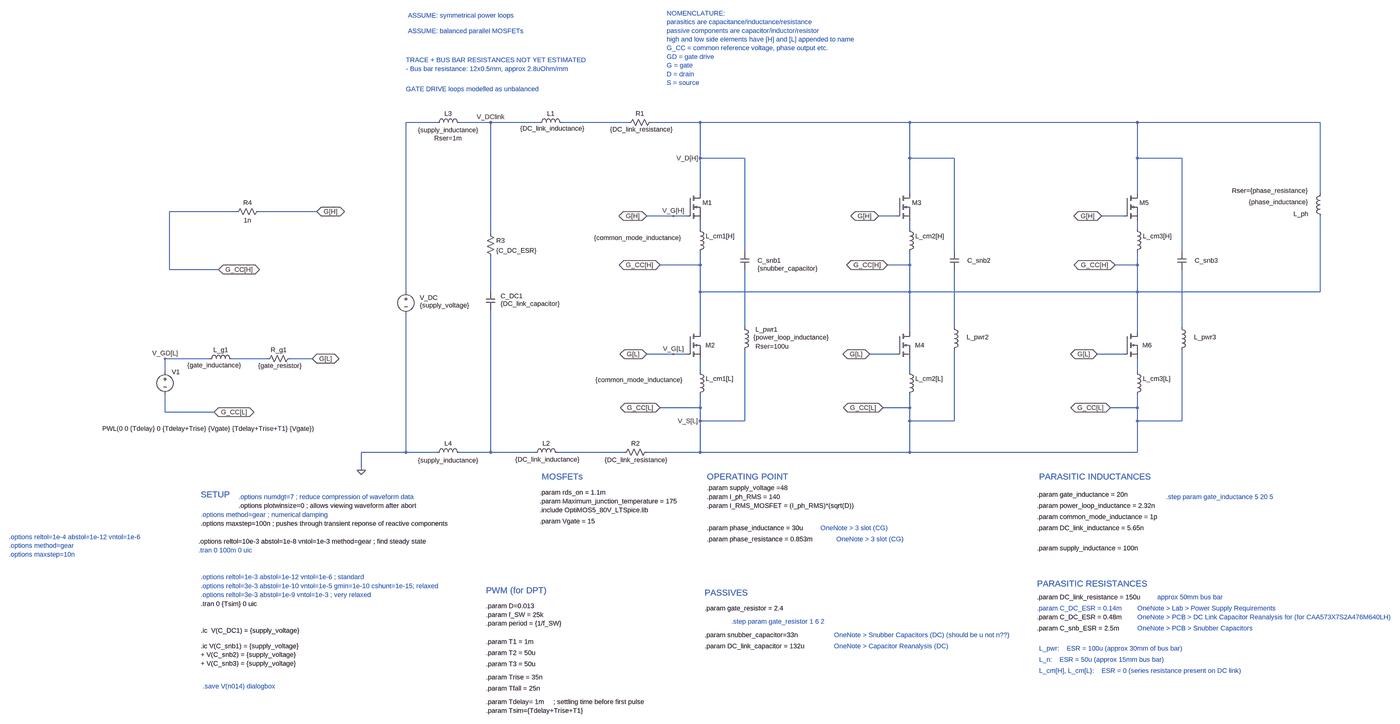
[diagram p0: schematic InverterBalancedDPT_debug.asc, whole sheet]
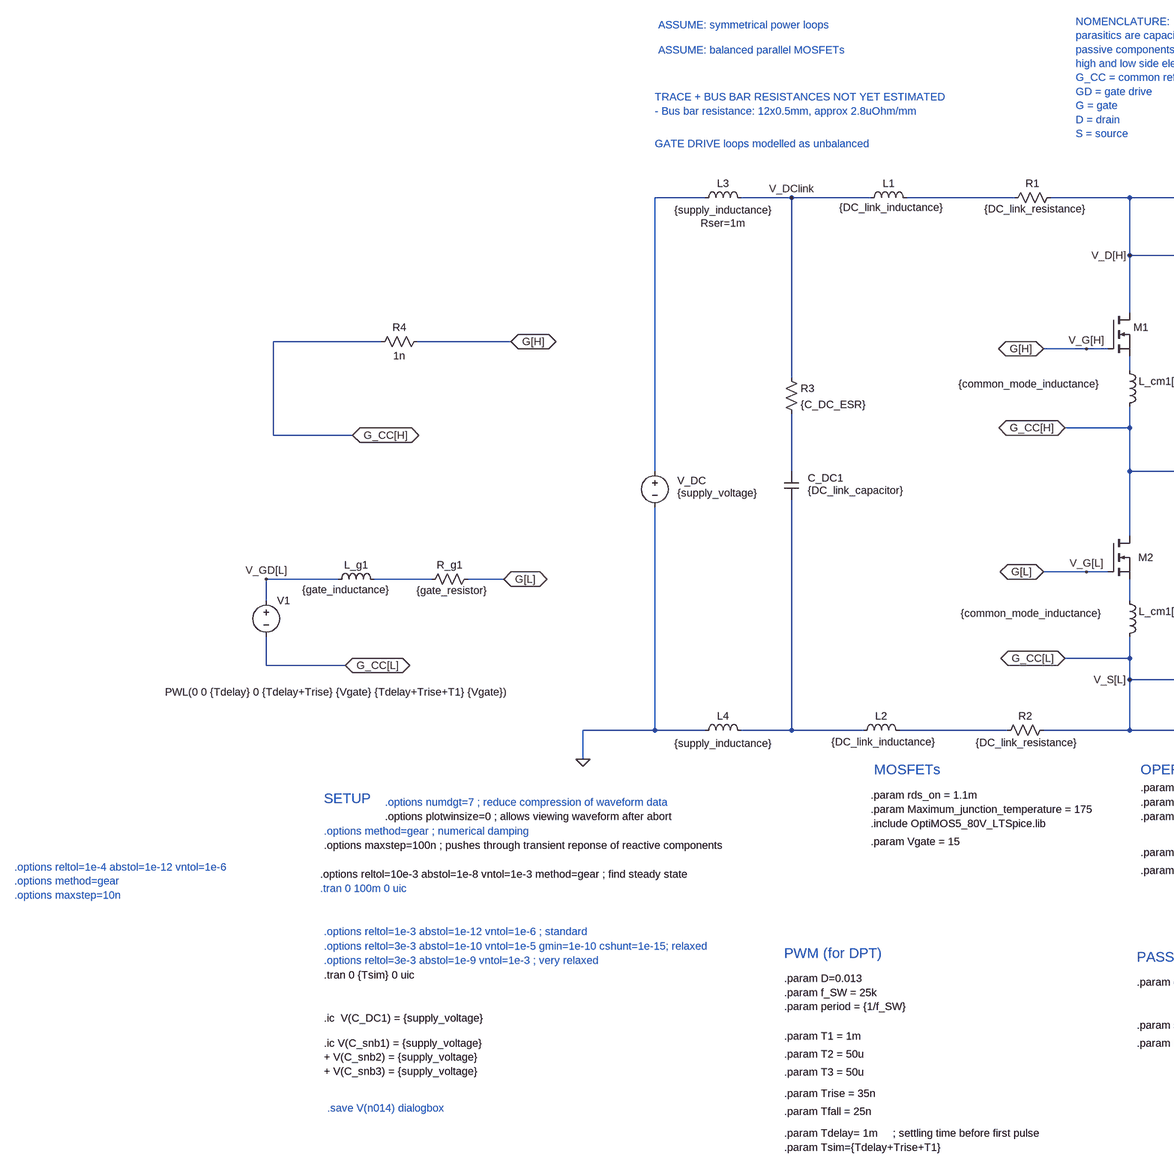
[diagram p1: schematic InverterBalancedDPT_debug.asc, part, row 1 of 1, column 1 of 2]
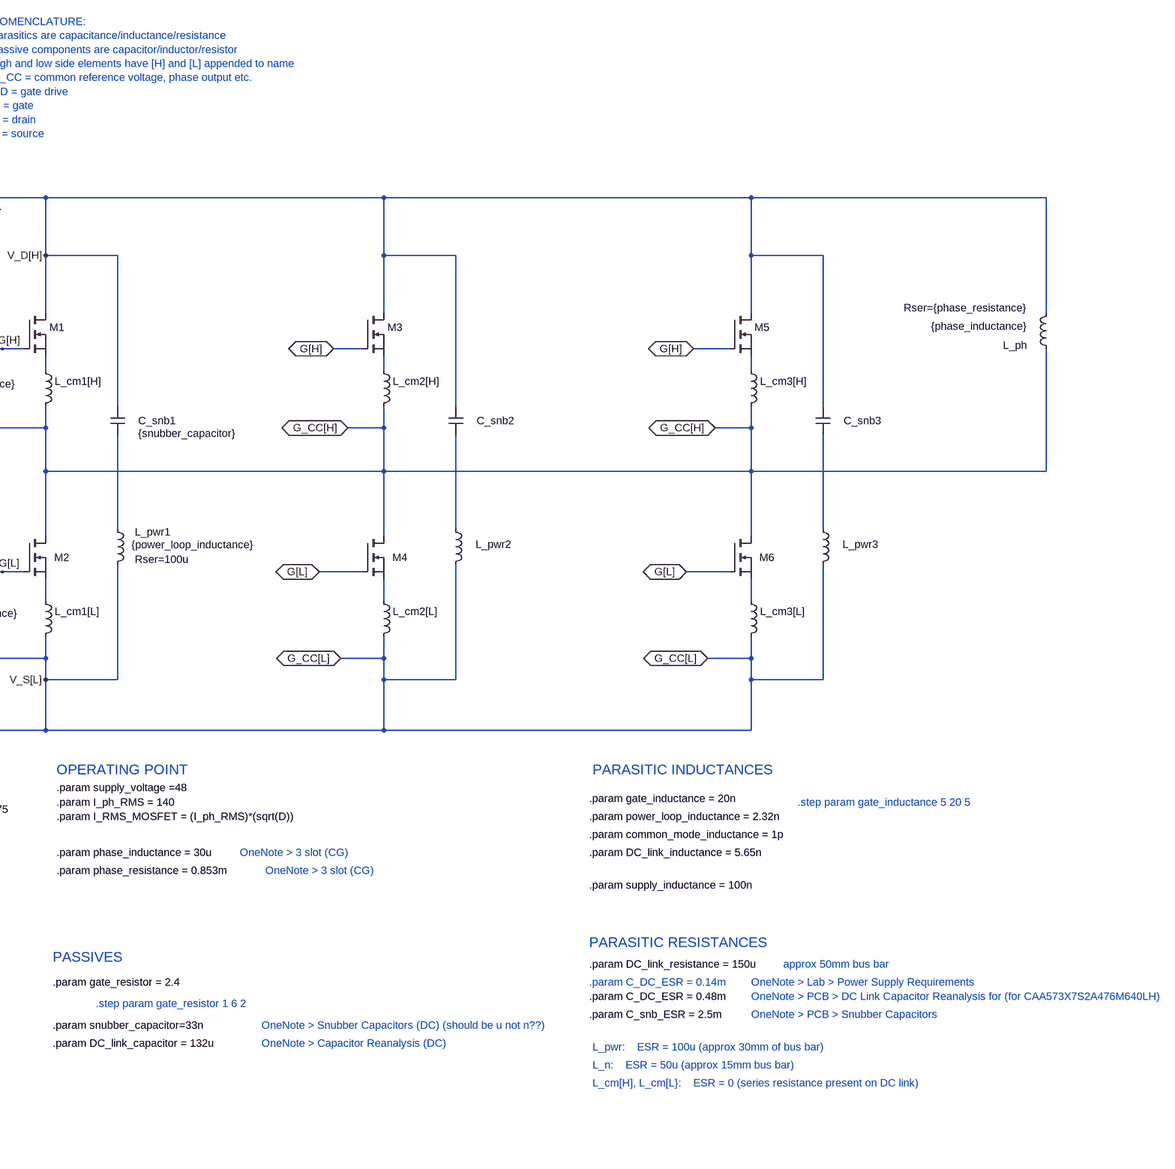
[diagram p2: schematic InverterBalancedDPT_debug.asc, part, row 1 of 1, column 2 of 2]
InverterBalancedDPT_debug.asc, the LTspice schematic file:
Version 4.1
SHEET 1 7948 3392
WIRE 1136 -928 1024 -928
WIRE 1328 -928 1216 -928
WIRE 1504 -928 1328 -928
WIRE 1824 -928 1584 -928
WIRE 2080 -928 1904 -928
WIRE 2832 -928 2080 -928
WIRE 3648 -928 2832 -928
WIRE 4304 -928 3648 -928
WIRE 2080 -800 2080 -928
WIRE 2240 -800 2080 -800
WIRE 2832 -800 2832 -928
WIRE 2992 -800 2832 -800
WIRE 3648 -800 3648 -928
WIRE 3808 -800 3648 -800
WIRE 2080 -672 2080 -800
WIRE 2832 -672 2832 -800
WIRE 3648 -672 3648 -800
WIRE 4304 -672 4304 -928
WIRE 416 -608 176 -608
WIRE 704 -608 496 -608
WIRE 1984 -592 1888 -592
WIRE 2032 -592 1984 -592
WIRE 2080 -592 2080 -608
WIRE 2784 -592 2720 -592
WIRE 2832 -592 2832 -608
WIRE 3600 -592 3520 -592
WIRE 3648 -592 3648 -608
WIRE 2080 -544 2080 -576
WIRE 2832 -544 2832 -576
WIRE 3648 -544 3648 -576
WIRE 1328 -528 1328 -928
WIRE 2240 -464 2240 -800
WIRE 2992 -464 2992 -800
WIRE 3808 -464 3808 -800
WIRE 2080 -416 2080 -464
WIRE 2080 -416 1936 -416
WIRE 2832 -416 2832 -464
WIRE 2832 -416 2752 -416
WIRE 3648 -416 3648 -464
WIRE 3648 -416 3568 -416
WIRE 176 -400 176 -608
WIRE 352 -400 176 -400
WIRE 1024 -320 1024 -928
WIRE 1328 -320 1328 -448
WIRE 2080 -320 2080 -416
WIRE 2832 -320 2832 -416
WIRE 2832 -320 2080 -320
WIRE 3648 -320 3648 -416
WIRE 3648 -320 2832 -320
WIRE 4304 -320 4304 -592
WIRE 4304 -320 3648 -320
WIRE 2240 -192 2240 -400
WIRE 2992 -192 2992 -400
WIRE 3808 -192 3808 -400
WIRE 2080 -176 2080 -320
WIRE 2832 -176 2832 -320
WIRE 3648 -176 3648 -320
WIRE 1984 -96 1888 -96
WIRE 2032 -96 1984 -96
WIRE 2784 -96 2688 -96
WIRE 3600 -96 3504 -96
WIRE 320 -80 160 -80
WIRE 528 -80 400 -80
WIRE 688 -80 608 -80
WIRE 160 -32 160 -80
WIRE 2080 -32 2080 -80
WIRE 2832 -32 2832 -80
WIRE 3648 -32 3648 -80
WIRE 2080 96 2080 48
WIRE 2080 96 1936 96
WIRE 2832 96 2832 48
WIRE 2832 96 2736 96
WIRE 3648 96 3648 48
WIRE 3648 96 3552 96
WIRE 160 112 160 48
WIRE 336 112 160 112
WIRE 2080 144 2080 96
WIRE 2240 144 2240 -112
WIRE 2240 144 2080 144
WIRE 2832 144 2832 96
WIRE 2992 144 2992 -112
WIRE 2992 144 2832 144
WIRE 3648 144 3648 96
WIRE 3808 144 3808 -112
WIRE 3808 144 3648 144
WIRE 1024 256 1024 -240
WIRE 1024 256 864 256
WIRE 1136 256 1024 256
WIRE 1328 256 1328 -256
WIRE 1328 256 1216 256
WIRE 1488 256 1328 256
WIRE 1808 256 1568 256
WIRE 2080 256 2080 144
WIRE 2080 256 1888 256
WIRE 2832 256 2832 144
WIRE 2832 256 2080 256
WIRE 3648 256 3648 144
WIRE 3648 256 2832 256
WIRE 864 320 864 256
FLAG 704 -608 G[H]
IOPIN 704 -608 BiDir
FLAG 688 -80 G[L]
IOPIN 688 -80 BiDir
FLAG 1888 -592 G[H]
IOPIN 1888 -592 BiDir
FLAG 1888 -96 G[L]
IOPIN 1888 -96 BiDir
FLAG 864 320 0
FLAG 1936 -416 G_CC[H]
IOPIN 1936 -416 BiDir
FLAG 352 -400 G_CC[H]
IOPIN 352 -400 BiDir
FLAG 1984 -592 V_G[H]
FLAG 1984 -96 V_G[L]
FLAG 2080 -800 V_D[H]
FLAG 2080 144 V_S[L]
FLAG 160 -80 V_GD[L]
FLAG 1328 -928 V_DClink
FLAG 2720 -592 G[H]
IOPIN 2720 -592 BiDir
FLAG 1936 96 G_CC[L]
IOPIN 1936 96 BiDir
FLAG 336 112 G_CC[L]
IOPIN 336 112 BiDir
FLAG 2688 -96 G[L]
IOPIN 2688 -96 BiDir
FLAG 3504 -96 G[L]
IOPIN 3504 -96 BiDir
FLAG 3520 -592 G[H]
IOPIN 3520 -592 BiDir
FLAG 2752 -416 G_CC[H]
IOPIN 2752 -416 BiDir
FLAG 3568 -416 G_CC[H]
IOPIN 3568 -416 BiDir
FLAG 2736 96 G_CC[L]
IOPIN 2736 96 BiDir
FLAG 3552 96 G_CC[L]
IOPIN 3552 96 BiDir
SYMBOL voltage 1024 -336 R0
WINDOW 3 50 65 Left 2
WINDOW 0 50 37 Left 2
WINDOW 123 0 0 Left 0
SYMATTR Value {supply_voltage}
SYMATTR InstName V_DC
SYMATTR SpiceLine Rser=0
SYMBOL cap 1312 -320 R0
WINDOW 0 52 15 Left 2
WINDOW 3 52 43 Left 2
SYMATTR InstName C_DC1
SYMATTR Value {DC_link_capacitor}
SYMATTR SpiceLine Rser=0
SYMBOL cap 2224 -464 R0
WINDOW 0 62 32 Left 2
WINDOW 3 62 60 Left 2
SYMATTR InstName C_snb1
SYMATTR Value {snubber_capacitor}
SYMATTR SpiceLine Rser=0
SYMBOL ind 4320 -576 R180
WINDOW 0 58 24 Left 2
WINDOW 3 59 66 Left 2
WINDOW 39 61 107 Left 2
SYMATTR InstName L_ph
SYMATTR Value {phase_inductance}
SYMATTR SpiceLine Rser={phase_resistance}
SYMBOL nmos 2032 -672 R0
WINDOW 3 56 72 Invisible 2
SYMATTR Value IPTG011N08NM5_L0
SYMATTR InstName M1
SYMATTR Prefix X
SYMBOL nmos 2032 -176 R0
WINDOW 0 67 48 Left 2
WINDOW 3 56 72 Invisible 2
SYMATTR InstName M2
SYMATTR Value IPTG011N08NM5_L0
SYMATTR Prefix X
SYMBOL ind 2064 -560 R0
WINDOW 3 -365 46 Left 2
SYMATTR Value {common_mode_inductance}
SYMATTR InstName L_cm1[H]
SYMATTR SpiceLine Rser=0
SYMBOL ind 2064 -48 R0
WINDOW 3 -360 44 Left 2
SYMATTR Value {common_mode_inductance}
SYMATTR InstName L_cm1[L]
SYMATTR SpiceLine Rser=0
SYMBOL ind 2224 -208 R0
WINDOW 0 54 23 Left 2
WINDOW 3 47 52 Left 2
WINDOW 39 54 84 Left 2
SYMATTR InstName L_pwr1
SYMATTR Value {power_loop_inductance}
SYMATTR SpiceLine Rser=100u
SYMBOL cap 2976 -464 R0
WINDOW 0 62 32 Left 2
WINDOW 3 24 56 Invisible 2
SYMATTR InstName C_snb2
SYMATTR Value {snubber_capacitor}
SYMBOL nmos 2784 -672 R0
WINDOW 3 56 72 Invisible 2
SYMATTR Value IPTG011N08NM5_L0
SYMATTR InstName M3
SYMATTR Prefix X
SYMBOL nmos 2784 -176 R0
WINDOW 0 67 48 Left 2
WINDOW 3 56 72 Invisible 2
SYMATTR InstName M4
SYMATTR Value IPTG011N08NM5_L0
SYMATTR Prefix X
SYMBOL ind 2816 -560 R0
WINDOW 3 36 80 Invisible 2
SYMATTR Value {common_mode_inductance}
SYMATTR InstName L_cm2[H]
SYMATTR SpiceLine Rser=0
SYMBOL ind 2816 -48 R0
WINDOW 3 36 80 Invisible 2
SYMATTR Value {common_mode_inductance}
SYMATTR InstName L_cm2[L]
SYMATTR SpiceLine Rser=0
SYMBOL ind 2976 -208 R0
WINDOW 0 60 51 Left 2
WINDOW 3 36 80 Invisible 2
SYMATTR InstName L_pwr2
SYMATTR Value {power_loop_inductance}
SYMATTR SpiceLine Rser=100u
SYMBOL cap 3792 -464 R0
WINDOW 0 62 32 Left 2
WINDOW 3 24 56 Invisible 2
SYMATTR InstName C_snb3
SYMATTR Value {snubber_capacitor}
SYMBOL nmos 3600 -672 R0
WINDOW 3 56 72 Invisible 2
SYMATTR Value IPTG011N08NM5_L0
SYMATTR InstName M5
SYMATTR Prefix X
SYMBOL nmos 3600 -176 R0
WINDOW 0 67 48 Left 2
WINDOW 3 56 72 Invisible 2
SYMATTR InstName M6
SYMATTR Value IPTG011N08NM5_L0
SYMATTR Prefix X
SYMBOL ind 3632 -560 R0
WINDOW 3 36 80 Invisible 2
SYMATTR Value {common_mode_inductance}
SYMATTR InstName L_cm3[H]
SYMATTR SpiceLine Rser=0
SYMBOL ind 3632 -48 R0
WINDOW 3 36 80 Invisible 2
SYMATTR Value {common_mode_inductance}
SYMATTR InstName L_cm3[L]
SYMATTR SpiceLine Rser=0
SYMBOL ind 3792 -208 R0
WINDOW 0 60 51 Left 2
WINDOW 3 36 80 Invisible 2
SYMATTR InstName L_pwr3
SYMATTR Value {power_loop_inductance}
SYMATTR SpiceLine Rser=100u
SYMBOL ind 1488 -912 R270
WINDOW 0 32 56 VTop 2
WINDOW 3 -21 62 VTop 2
SYMATTR InstName L1
SYMATTR Value {DC_link_inductance}
SYMATTR SpiceLine Rser=0
SYMBOL ind 1472 272 R270
WINDOW 0 32 56 VTop 2
WINDOW 3 -26 60 VTop 2
SYMATTR InstName L2
SYMATTR Value {DC_link_inductance}
SYMATTR SpiceLine Rser=0
SYMBOL res 1920 -944 R90
WINDOW 0 0 56 VBottom 2
WINDOW 3 57 51 VBottom 2
SYMATTR InstName R1
SYMATTR Value {DC_link_resistance}
SYMBOL res 1904 240 R90
WINDOW 0 0 56 VBottom 2
WINDOW 3 59 54 VBottom 2
SYMATTR InstName R2
SYMATTR Value {DC_link_resistance}
SYMBOL ind 1120 -912 R270
WINDOW 0 32 56 VTop 2
WINDOW 3 -27 56 VTop 2
WINDOW 39 -56 55 VTop 2
SYMATTR InstName L3
SYMATTR Value {supply_inductance}
SYMATTR SpiceLine Rser=1m
SYMBOL ind 1120 272 R270
WINDOW 0 32 56 VTop 2
WINDOW 3 -29 56 VTop 2
SYMATTR InstName L4
SYMATTR Value {supply_inductance}
SYMATTR SpiceLine Rser=1m
SYMBOL res 1312 -544 R0
SYMATTR InstName R3
SYMATTR Value {C_DC_ESR}
SYMBOL ind 304 -64 R270
WINDOW 0 32 56 VTop 2
WINDOW 3 -23 33 VTop 2
SYMATTR InstName L_g1
SYMATTR Value {gate_inductance}
SYMATTR SpiceLine Rser=0
SYMBOL res 512 -64 R270
WINDOW 0 32 56 VTop 2
WINDOW 3 -25 61 VTop 2
SYMATTR InstName R_g1
SYMATTR Value {gate_resistor}
SYMBOL voltage 160 -48 R0
WINDOW 123 0 0 Left 0
WINDOW 39 0 0 Left 0
WINDOW 3 -225 219 Left 2
SYMATTR Value PWL(0 0 {Tdelay} 0 {Tdelay+Trise} {Vgate} {Tdelay+Trise+T1} {Vgate})
SYMATTR InstName V1
SYMBOL res 512 -624 R90
WINDOW 0 0 56 VBottom 2
WINDOW 3 32 56 VTop 2
SYMATTR InstName R4
SYMATTR Value 1n
TEXT 1312 808 Left 2 !.param D=0.013\n.param f_SW = 25k\n.param period = {1/f_SW}
TEXT 288 704 Left 2 ;.options reltol=1e-3 abstol=1e-12 vntol=1e-6 ; standard
TEXT 1504 464 Left 2 !.include OptiMOS5_80V_LTSpice.lib
TEXT 2096 912 Left 2 !.param snubber_capacitor=33n
TEXT 2096 952 Left 2 !.param DC_link_capacitor = 132u
TEXT 2104 384 Left 2 !.param supply_voltage =48
TEXT 2104 568 Left 2 !.param phase_resistance = 0.853m
TEXT 2104 528 Left 2 !.param phase_inductance = 30u
TEXT 2104 416 Left 2 !.param I_ph_RMS = 140
TEXT 2104 448 Left 2 !.param I_RMS_MOSFET = (I_ph_RMS)*(sqrt(D))
TEXT 1504 432 Left 2 !.param Maximum_junction_temperature = 175
TEXT 1504 400 Left 2 !.param rds_on = 1.1m
TEXT 3288 488 Left 2 !.param common_mode_inductance = 1p
TEXT 3288 448 Left 2 !.param power_loop_inductance = 2.32n
TEXT 2096 816 Left 2 !.param gate_resistor = 2.4
TEXT 3288 408 Left 2 !.param gate_inductance = 20n
TEXT 288 408 Left 3 ;SETUP
TEXT 1512 344 Left 3 ;MOSFETs
TEXT 2104 344 Left 3 ;OPERATING POINT
TEXT 3296 344 Left 3 ;PARASITIC INDUCTANCES
TEXT 2096 760 Left 3 ;PASSIVES
TEXT 1504 504 Left 2 !.param Vgate = 15
TEXT 2192 864 Left 2 ;.step param gate_resistor 1 6 2
TEXT 3288 528 Left 2 !.param DC_link_inductance = 5.65n
TEXT 1032 -1312 Left 2 ;ASSUME: symmetrical power loops
TEXT 1024 -1152 Left 2 ;TRACE + BUS BAR RESISTANCES NOT YET ESTIMATED\n- Bus bar resistance: 12x0.5mm, approx 2.8uOhm/mm
TEXT 1032 -1256 Left 2 ;ASSUME: balanced parallel MOSFETs
TEXT 280 608 Left 2 ;.tran 0 100m 0 uic
TEXT 1024 -1048 Left 2 ;GATE DRIVE loops modelled as unbalanced
TEXT 3288 600 Left 2 !.param supply_inductance = 100n
TEXT 3288 728 Left 3 ;PARASITIC RESISTANCES
TEXT 3288 776 Left 2 !.param DC_link_resistance = 150u
TEXT 3288 816 Left 2 ;.param C_DC_ESR = 0.14m
TEXT 2560 952 Left 2 ;OneNote > Capacitor Reanalysis (DC)
TEXT 2560 912 Left 2 ;OneNote > Snubber Capacitors (DC) (should be u not n??)
TEXT 2512 528 Left 2 ;OneNote > 3 slot (CG)
TEXT 2568 568 Left 2 ;OneNote > 3 slot (CG)
TEXT 424 448 Left 2 !.options plotwinsize=0 ; allows viewing waveform after abort
TEXT 1960 -1320 Left 2 ;NOMENCLATURE: \nparasitics are capacitance/inductance/resistance\npassive components are capacitor/inductor/resistor\nhigh and low side elements have [H] and [L] appended to name\nG_CC = common reference voltage, phase output etc.\nGD = gate drive\nG = gate\nD = drain\nS = source
TEXT 288 512 Left 2 !.options maxstep=100n ; pushes through transient reponse of reactive components
TEXT 288 768 Left 2 ;.options reltol=3e-3 abstol=1e-9 vntol=1e-3 ; very relaxed
TEXT 280 576 Left 2 !.options reltol=10e-3 abstol=1e-8 vntol=1e-3 method=gear ; find steady state
TEXT 1312 752 Left 3 ;PWM (for DPT)
TEXT 3296 960 Left 2 ;L_pwr:    ESR = 100u (approx 30mm of bus bar)
TEXT 3296 1040 Left 2 ;L_cm[H], L_cm[L}:    ESR = 0 (series resistance present on DC link)
TEXT 3296 1000 Left 2 ;L_n:    ESR = 50u (approx 15mm bus bar)
TEXT 3648 816 Left 2 ;OneNote > Lab > Power Supply Requirements
TEXT 3288 888 Left 2 !.param C_snb_ESR = 2.5m
TEXT 3288 848 Left 2 !.param C_DC_ESR = 0.48m
TEXT 3648 848 Left 2 ;OneNote > PCB > DC Link Capacitor Reanalysis for (for CAA573X7S2A476M640LH)
TEXT 3720 776 Left 2 ;approx 50mm bus bar
TEXT 3648 888 Left 2 ;OneNote > PCB > Snubber Capacitors
TEXT 1312 936 Left 2 !.param T1 = 1m
TEXT 1312 976 Left 2 !.param T2 = 50u
TEXT 1312 1016 Left 2 !.param T3 = 50u
TEXT 1312 1064 Left 2 !.param Trise = 35n
TEXT 1312 1104 Left 2 !.param Tfall = 25n
TEXT 1312 1184 Left 2 !.param Tsim={Tdelay+Trise+T1}
TEXT 288 800 Left 2 !.tran 0 {Tsim} 0 uic
TEXT 1312 1152 Left 2 !.param Tdelay= 1m     ; settling time before first pulse
TEXT 288 896 Left 2 !.ic  V(C_DC1) = {supply_voltage}
TEXT 3752 416 Left 2 ;.step param gate_inductance 5 20 5
TEXT 288 480 Left 2 ;.options method=gear ; numerical damping
TEXT 288 736 Left 2 ;.options reltol=3e-3 abstol=1e-10 vntol=1e-5 gmin=1e-10 cshunt=1e-15; relaxed
TEXT 424 416 Left 2 ;.options numdgt=7 ; reduce compression of waveform data
TEXT 288 952 Left 2 !.ic V(C_snb1) = {supply_voltage}\n+ V(C_snb2) = {supply_voltage}\n+ V(C_snb3) = {supply_voltage}
TEXT 296 1096 Left 2 ;.save V(n014) dialogbox
TEXT -400 560 Left 2 ;.options reltol=1e-4 abstol=1e-12 vntol=1e-6\n.options method=gear\n.options maxstep=10n

The netlist it stands for:
* InverterBalancedDPT_debug.asc
V_DC N001 0 {supply_voltage} Rser=0
C_DC1 N009 N017 {DC_link_capacitor} Rser=0
C_snb1 V_D[H] N010 {snubber_capacitor} Rser=0
L_ph G_CC[H] V_D[H] {phase_inductance} Rser={phase_resistance}
X§M1 V_D[H] V_G[H] N006 IPTG011N08NM5_L0  ; pins D G S
X§M2 G_CC[H] V_G[L] N014 IPTG011N08NM5_L0  ; pins D G S
L_cm1[H] N006 G_CC[H] {common_mode_inductance} Rser=0
L_cm1[L] N014 G_CC[L] {common_mode_inductance} Rser=0
L_pwr1 N010 G_CC[L] {power_loop_inductance} Rser=100u
C_snb2 V_D[H] N011 {snubber_capacitor}
X§M3 V_D[H] V_G[H] N007 IPTG011N08NM5_L0  ; pins D G S
X§M4 G_CC[H] V_G[L] N015 IPTG011N08NM5_L0  ; pins D G S
L_cm2[H] N007 G_CC[H] {common_mode_inductance} Rser=0
L_cm2[L] N015 G_CC[L] {common_mode_inductance} Rser=0
L_pwr2 N011 G_CC[L] {power_loop_inductance} Rser=100u
C_snb3 V_D[H] N012 {snubber_capacitor}
X§M5 V_D[H] V_G[H] N008 IPTG011N08NM5_L0  ; pins D G S
X§M6 G_CC[H] V_G[L] N016 IPTG011N08NM5_L0  ; pins D G S
L_cm3[H] N008 G_CC[H] {common_mode_inductance} Rser=0
L_cm3[L] N016 G_CC[L] {common_mode_inductance} Rser=0
L_pwr3 N012 G_CC[L] {power_loop_inductance} Rser=100u
L1 V_DClink N002 {DC_link_inductance} Rser=0
L2 N017 N018 {DC_link_inductance} Rser=0
R1 V_D[H] N002 {DC_link_resistance}
R2 G_CC[L] N018 {DC_link_resistance}
L3 N001 V_DClink {supply_inductance} Rser=1m
L4 0 N017 {supply_inductance} Rser=1m
R3 V_DClink N009 {C_DC_ESR}
L_g1 V_GD[L] N013 {gate_inductance} Rser=0
R_g1 N013 V_G[L] {gate_resistor}
V1 V_GD[L] G_CC[L] PWL(0 0 {Tdelay} 0 {Tdelay+Trise} {Vgate} {Tdelay+Trise+T1} {Vgate})
R4 V_G[H] G_CC[H] 1n
.param D=0.013
.param f_SW = 25k
.param period = {1/f_SW}
* .options reltol=1e-3 abstol=1e-12 vntol=1e-6 ; standard
.include OptiMOS5_80V_LTSpice.lib
.param snubber_capacitor=33n
.param DC_link_capacitor = 132u
.param supply_voltage =48
.param phase_resistance = 0.853m
.param phase_inductance = 30u
.param I_ph_RMS = 140
.param I_RMS_MOSFET = (I_ph_RMS)*(sqrt(D))
.param Maximum_junction_temperature = 175
.param rds_on = 1.1m
.param common_mode_inductance = 1p
.param power_loop_inductance = 2.32n
.param gate_resistor = 2.4
.param gate_inductance = 20n
* SETUP
* MOSFETs
* OPERATING POINT
* PARASITIC INDUCTANCES
* PASSIVES
.param Vgate = 15
* .step param gate_resistor 1 6 2
.param DC_link_inductance = 5.65n
* ASSUME: symmetrical power loops
* TRACE + BUS BAR RESISTANCES NOT YET ESTIMATED
* - Bus bar resistance: 12x0.5mm, approx 2.8uOhm/mm
* ASSUME: balanced parallel MOSFETs
* .tran 0 100m 0 uic
* GATE DRIVE loops modelled as unbalanced
.param supply_inductance = 100n
* PARASITIC RESISTANCES
.param DC_link_resistance = 150u
* .param C_DC_ESR = 0.14m
* OneNote > Capacitor Reanalysis (DC)
* OneNote > Snubber Capacitors (DC) (should be u not n??)
* OneNote > 3 slot (CG)
* OneNote > 3 slot (CG)
.options plotwinsize=0 ; allows viewing waveform after abort
* NOMENCLATURE:
* parasitics are capacitance/inductance/resistance
* passive components are capacitor/inductor/resistor
* high and low side elements have [H] and [L] appended to name
* G_CC = common reference voltage, phase output etc.
* GD = gate drive
* G = gate
* D = drain
* S = source
.options maxstep=100n ; pushes through transient reponse of reactive components
* .options reltol=3e-3 abstol=1e-9 vntol=1e-3 ; very relaxed
.options reltol=10e-3 abstol=1e-8 vntol=1e-3 method=gear ; find steady state
* PWM (for DPT)
* L_pwr:    ESR = 100u (approx 30mm of bus bar)
* L_cm[H], L_cm[L}:    ESR = 0 (series resistance present on DC link)
* L_n:    ESR = 50u (approx 15mm bus bar)
* OneNote > Lab > Power Supply Requirements
.param C_snb_ESR = 2.5m
.param C_DC_ESR = 0.48m
* OneNote > PCB > DC Link Capacitor Reanalysis for (for CAA573X7S2A476M640LH)
* approx 50mm bus bar
* OneNote > PCB > Snubber Capacitors
.param T1 = 1m
.param T2 = 50u
.param T3 = 50u
.param Trise = 35n
.param Tfall = 25n
.param Tsim={Tdelay+Trise+T1}
.tran 0 {Tsim} 0 uic
.param Tdelay= 1m     ; settling time before first pulse
.ic  V(C_DC1) = {supply_voltage}
* .step param gate_inductance 5 20 5
* .options method=gear ; numerical damping
* .options reltol=3e-3 abstol=1e-10 vntol=1e-5 gmin=1e-10 cshunt=1e-15; relaxed
* .options numdgt=7 ; reduce compression of waveform data
.ic V(C_snb1) = {supply_voltage}
+ V(C_snb2) = {supply_voltage}
+ V(C_snb3) = {supply_voltage}
* .save V(n014) dialogbox
* .options reltol=1e-4 abstol=1e-12 vntol=1e-6
* .options method=gear
* .options maxstep=10n
.backanno
.end